# Altium schematic sheet sb-sonata-ethmac.SchDoc: Ethernet MAC (SPI)
size Letter; Organization: NewAE Technology Inc.; Address1: 1083 Queen St., Suite 196; Address2: Halifax; Address3: NS; Address4: Canada B3H 0B2; SheetNumber: 10; SheetTotal: 20; SheetApproved: YES
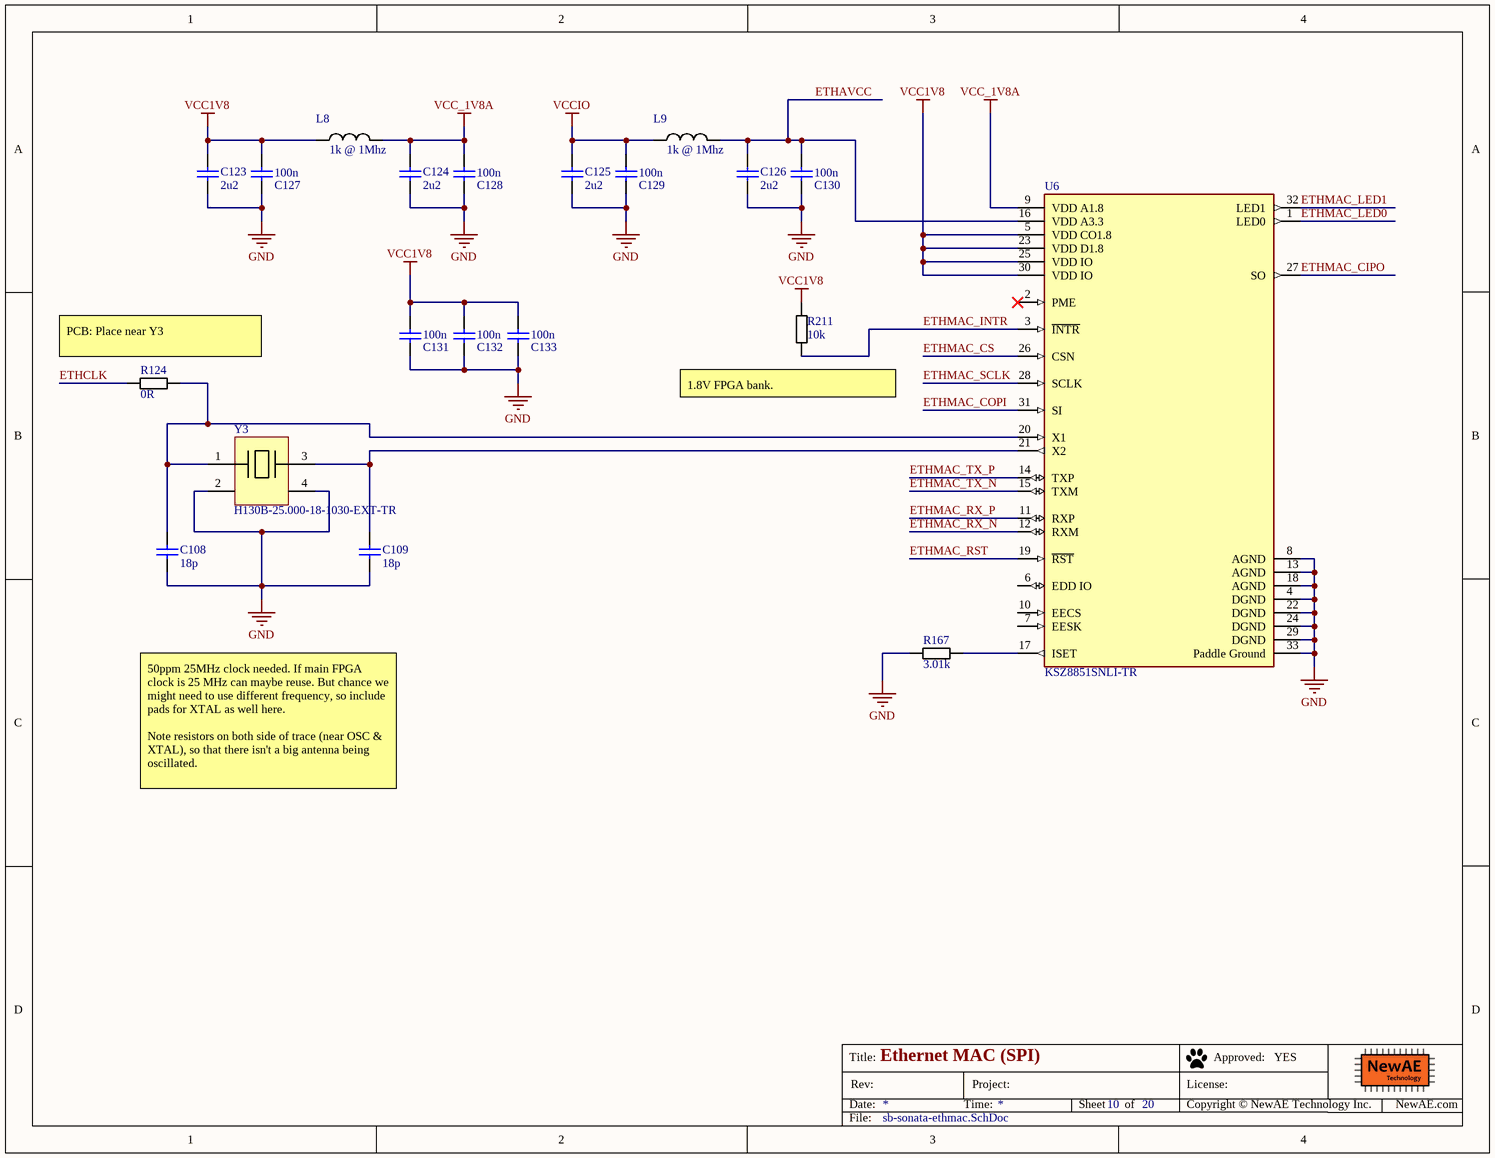
[diagram p0: sb-sonata-ethmac.SchDoc]

## Parts
C108  18p  [CAPC0402_M]
C109  18p  [CAPC0402_M]
C123  2u2  [CAPC0603_M]
C124  2u2  [CAPC0603_M]
C125  2u2  [CAPC0603_M]
C126  2u2  [CAPC0603_M]
C127  100n  [CAPC0402_M]
C128  100n  [CAPC0402_M]
C129  100n  [CAPC0402_M]
C130  100n  [CAPC0402_M]
C131  100n  [CAPC0402_M]
C132  100n  [CAPC0402_M]
C133  100n  [CAPC0402_M]
L8  1k @ 1Mhz  [IND_0603]
L9  1k @ 1Mhz  [IND_0603]
R124  0R  [RESC1608X55N]
R167  3.01k  [RESC1005X40N]
R211  10k  [RESC1005X40N]
U6  KSZ8851SNLI-TR  [FP-QFN55-32LD-PL-5-IPC_C]
Y3  Manufacturer Part Number: H130B-25.000-18-1030-EXT-TR  [5x3.2MM XTAL]  (hidden comment: H130B-12.000-16-2525-EXT-TR)

## Nets
GND: C108.2 C109.2 C123.2 C124.2 C125.2 C126.2 C127.2 C128.2 C129.2 C130.2 C131.2 C132.2 C133.2 R167.1 U6.4(DGND) U6.8(AGND) U6.13(AGND) U6.18(AGND) U6.22(DGND) U6.24(DGND) U6.29(DGND) U6.33(Paddle_Ground) Y3.2 Y3.4
VCC1V8: C123.1 C127.1 C131.1 C132.1 C133.1 L8.1 R211.1 U6.5(VDD_CO1.8) U6.23(VDD_D1.8) U6.25(VDD_IO) U6.30(VDD_IO)
VCC_1V8A: C124.1 C128.1 L8.2 U6.9(VDD_A1.8)
VCCIO: C125.1 C129.1 L9.1
ETHAVCC: C126.1 C130.1 L9.2 U6.16(VDD_A3.3)
ETHCLK: R124.1
ETHMAC_CIPO: U6.27(SO)
ETHMAC_COPI: U6.31(SI)
ETHMAC_CS: U6.26(CSN)
ETHMAC_INTR: R211.2 U6.3(~{INTR})
ETHMAC_LED0: U6.1(LED0)
ETHMAC_LED1: U6.32(LED1)
ETHMAC_RST: U6.19(~{RST})
ETHMAC_RX_N: U6.12(RXM)
ETHMAC_RX_P: U6.11(RXP)
ETHMAC_SCLK: U6.28(SCLK)
ETHMAC_TX_N: U6.15(TXM)
ETHMAC_TX_P: U6.14(TXP)
NetC108_1: C108.1 R124.2 U6.20(X1) Y3.1
NetC109_1: C109.1 U6.21(X2) Y3.3
NetR167_2: R167.2 U6.17(ISET)

Not connected (* = marked no-connect by the designer): U6 2(PME)* 6(EDD_IO) 7(EESK) 10(EECS)

## Notes on the sheet
- (near R124) PCB: Place near Y3
- (near R211) 1.8V FPGA bank.
- 50ppm 25MHz clock needed. If main FPGA clock is 25 MHz can maybe reuse. But chance we might need to use different frequency, so include pads for XTAL as well here.
  Note resistors on both side of trace (near OSC & XTAL), so that there isn't a big antenna being oscillated.
- Title:
- Date:
- Rev:
- Time:
- Project:
- Sheet
- of
- License:
- Copyright © NewAE Technology Inc.
- Approved:
- NewAE.com
- File:

## Library data of the parts
C108 C109 = CCHIP-18p-0402: 18p, 0402; Manufacture Part Number 1: GRM1555C1H180JA01D; Component Group: Capacitor; Case-EIA: 0402; Part Number: CCHIP-18p-0402; Footprint: 0402; Pin Count: 2; Supplier 1: Digi-Key; Supplier Part Number 1: 490-5858-1-ND; Value: 18p; Mounting Technology: SMT; Component Kind: Standard; Component Type: Standard
C123-C126 = CCHIP-2u2-0603: 2u2, 0603; Manufacture 1: Samsung; Manufacture Part Number 1: CL10B225KP8NNNC; Component Group: Capacitor; Case-EIA: 0603; Case-Metric: 1608; Rated Voltage: 10VDC; Part Number: CCHIP-2u2-0603; Footprint: 0603; Pin Count: 2; Supplier 1: Digi-Key; Supplier Part Number 1: 1276-1134-1-ND; Value: 2u2; Mounting Technology: SMT; Component Kind: Standard; Component Type: Standard
C127-C133 = CCHIP-100n-0402: 100n, 0402; Component Group: Capacitor; Case-EIA: 0402; Part Number: CCHIP-100n-0402; Footprint: 0402; Pin Count: 2; Value: 100n; Mounting Technology: SMT; Component Kind: Standard; Component Type: Standard; Supplier 1: Digi-Key; Supplier Part Number 1: 445-6901-1-ND
L8 L9 = FBCHIP-1k-0603: Ferrite Beads HI CUR CHIP BD 0603 1000OHMS 25%; Manufacture 1: Taiyo Yuden; Manufacture Part Number 1: FBMH1608HM102-T / FBMH1608HM102-T / FBMH1608HM102-T / FBMH1608HM102-T; Component Group: Inductor; PP Material Stack: 0; Part Number: FBCHIP-1k-0603; Footprint: 0603; Pin Count: 2; Supplier 1: Mouser; Supplier Part Number 1: 963-FBMH1608HM102-T; Mounting Technology: SMT; RoHS: Yes; Component Kind: Standard; Component Type: Standard; PP Rotation: 0
R124 = RCHIP-0R-0603: 0R, 0603, 1/10W; Manufacture 1: Yageo; Manufacture Part Number 1: RC0603FR-070RL; Component Group: Resistor; Case-EIA: 0603; Case-Metric: 1608; Rated Power: 0.1W; Rated Voltage: 75VDC; Tolerance: 1%; Part Number: RCHIP-0R-0603; Footprint: 0603; Pin Count: 2; Supplier 1: Digi-Key; Supplier Part Number 1: 311-0.0HRCT-ND; Value: 0R; Mounting Technology: SMT; Temperature Range: -55C to 155C; Component Kind: Standard; Component Type: Standard
R167 = RCHIP-3K01-0402: 3k01 res, 0402, 1%, 1/16W; Manufacture 1: Yageo; Manufacture Part Number 1: RC0402FR-073K01L; Component Group: Resistor; Case-EIA: 0402; Case-Metric: 1005; Rated Power: 0.063W; Rated Voltage: 75VDC; Part Number: RCHIP-3K01-0402; Footprint: 0402; Pin Count: 2; Supplier 1: Digi-Key; Supplier Part Number 1: 311-3.01KLRCT-ND; Value: 3.01k; Tolerance: 1%; Mounting Technology: SMT; Temperature Range: -55C to 155C; Component Kind: Standard; Component Type: Standard
R211 = RCHIP-10K-0402: 10k res, 0402, 1%, 1/16W; Manufacture 1: Yageo; Manufacture Part Number 1: RC0402FR-0710KL; Component Group: Resistor; Case-EIA: 0402; Case-Metric: 1005; Rated Power: 0.063W; Rated Voltage: 75VDC; Part Number: RCHIP-10K-0402; Footprint: 0402; Pin Count: 2; Supplier 1: Digi-Key; Supplier Part Number 1: 311-10.0KLRCT-ND; Value: 10k; Tolerance: 1%; Mounting Technology: SMT; Temperature Range: -55C to 155C; Component Kind: Standard; Component Type: Standard
U6 = CMP-2000-06522-2: IC ETHERNET CTLR 1PORT PCI 32MLF; Data Rate: 100Mbps; Interface: SPI; Nominal Supply Current: 75mA; Max Supply Voltage: 3.5V; Number of Functions: 1; Operating Supply Voltage: 3.3V; Min Supply Voltage: 3.1V; Max Supply Current: 85mA; Height: 0.85mm; Package Quantity: 1000; Series: -; Max Operating Temperature: 85°C; Packaging: Tape and Reel; Case/Package: QFN; Radiation Hardening: No; Lead Free: Lead Free; REACH SVHC: No SVHC; Number of Transceivers: 1; Number of Pins: 32; Min Operating Temperature: -40°C; Supply Current: 75mA; Length: 5mm; Width: 5mm; Supply Voltage-Nom: 3.3V; Number of Ports: 1; Mount: Surface Mount
Y3 = H130B-12.000-16-2525-EXT-TR: 12MHz ±25ppm Crystal 16pF 35 Ohms 4-SMD, No Lead; Manufacture 1: Raltron Electronics; Value: 25.000MHz; PP Material Stack: 0; Supplier 1: Digi-Key; Stock 1: 4955; Pricing 1: 1=0.590000, 10=0.488000, 50=0.439400, 100=0.390600, 500=0.371100 (USD); Supplier Part Number 1: 2151-H130B-12.000-16-2525-EXT-TR-ND; .Checked SCH: *; .Checked PCB: *; Part Number: H130B-25.000-18-1030-EXT-TR; Component Group: Crystal; Footprint: 5x3.2mm; Manufacture Part Number 1: H130B-25.000-18-1030-EXT-TR; Pin Count: 4; Mounting Technology: SMT; Component Kind: Standard; Component Type: Standard; PP Rotation: 0